# Altium project DARKYDEN.PrjPcb (part 11 of 14)

## Sheet P3V3_PP5V_GESTION.SchDoc: DARKYDEN_P3V3_PP5V_GESTION
size Letter; ApprovedBy: APPROUVÉ PAR; Author: Harold Malbrouck; Organization: Cegep Limoilou; Address1: 1300, 8e Avenue; Address2: Québec, QC; Address3: Canada; Address4: G1J 5L5; Revision: Rev.A; SheetNumber: 20; SheetTotal: 22
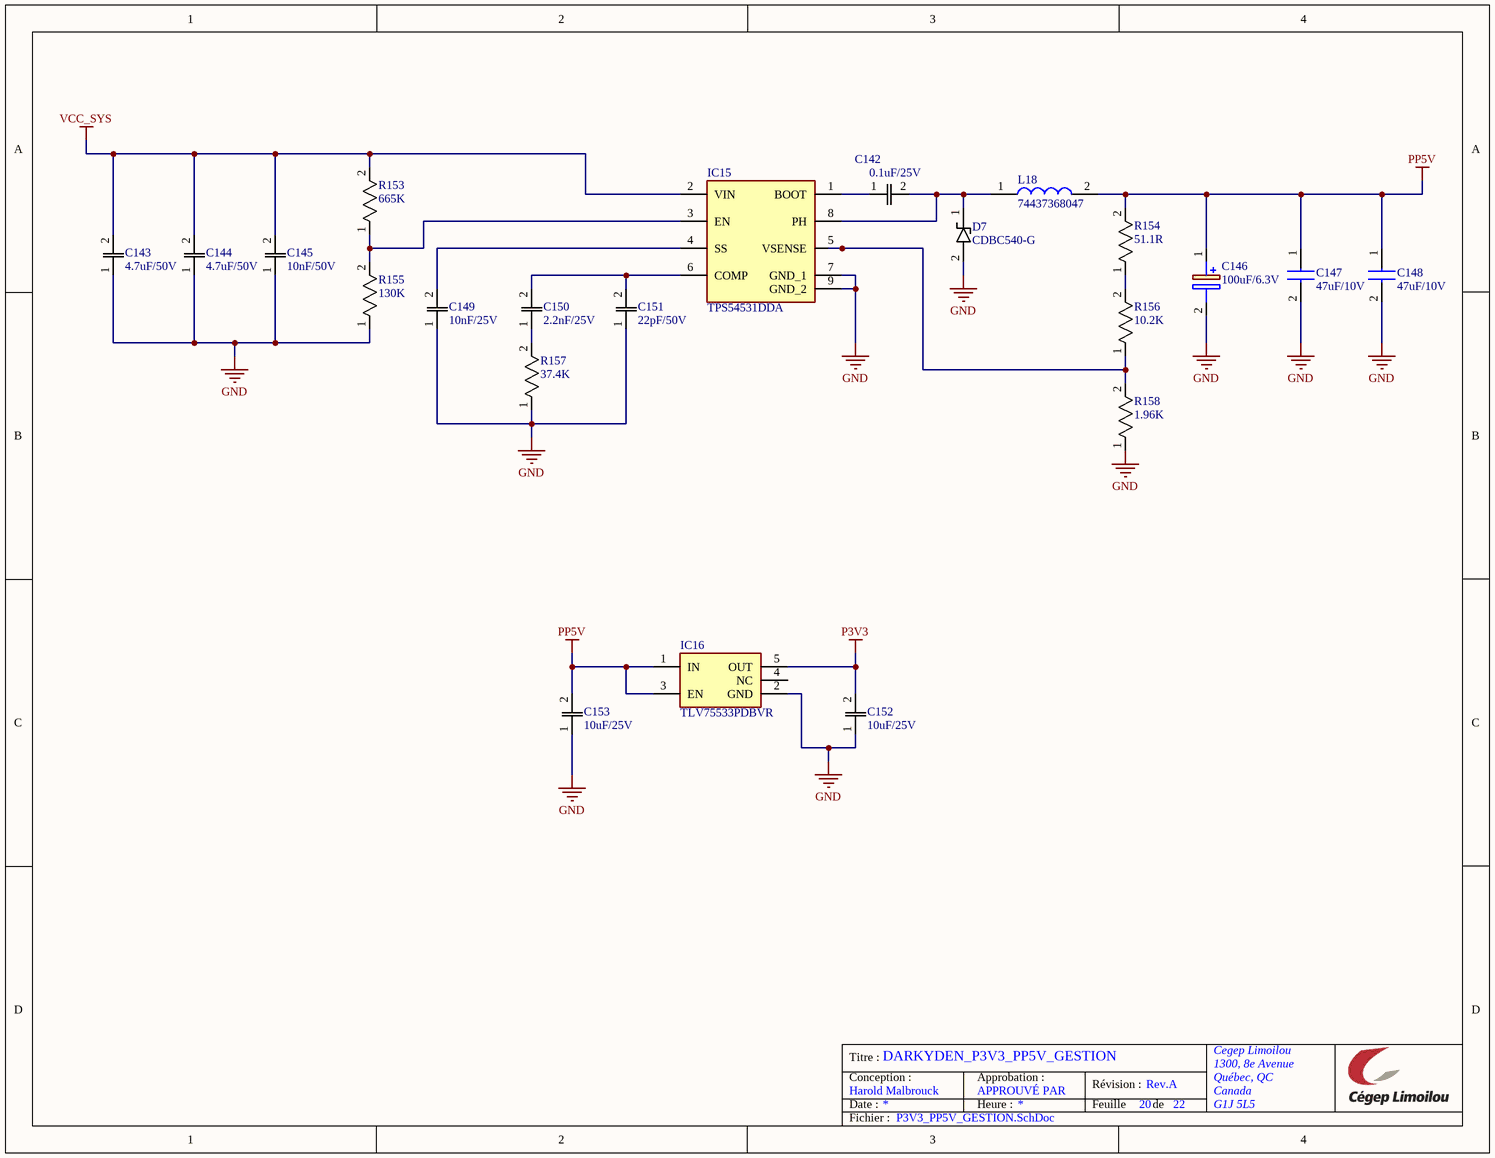
[diagram p12: P3V3_PP5V_GESTION.SchDoc]

### Parts
C142  0.1uF/25V  [CAPC220145_88N_KEM]
C143  4.7uF/50V  [CAP_2012_TDK]
C144  4.7uF/50V  [CAP_2012_TDK]
C145  10nF/50V  [CAPC220145_88N_KEM]
C146  100uF/6.3V  [T520B]
C147  47uF/10V  [CAPC3225X270N]
C148  47uF/10V  [CAPC3225X270N]
C149  10nF/25V  [C0805]
C150  2.2nF/25V  [CAPC480350_110N_KEM]
C151  22pF/50V  [CAPC220145_145N_KEM]
C152  10uF/25V  [CAPC220145_88N_KEM]
C153  10uF/25V  [CAPC220145_88N_KEM]
D7  CDBC540-G  [DIOM8059X290N]
IC15  TPS54531DDA  [SOIC127P600X170-9N]
IC16  TLV75533PDBVR  [SOT95P280X145-5N]
L18  74437368047  [WE-LHMI_104048]
R153  665K  [RC0603N_PAN]
R154  51.1R  [RESC1608X55N]
R155  130K  [RC0603N_PAN]
R156  10.2K  [RESC1608X55N]
R157  37.4K  [RC0603N_PAN]
R158  1.96K  [RC0603N_PAN]

### Nets
GND: C143.1 C144.1 C145.1 C146.2(-) C147.2 C148.2 C149.1 C151.1 C152.1 C153.1 D7.2(A) IC15.7(GND_1) IC15.9(GND_2) IC16.2(GND) R155.1 R157.1 R158.1  [project net PACK-]
P3V3: C152.2 IC16.5(OUT)
PP5V: C146.1(+) C147.1 C148.1 C153.2 IC16.1(IN) IC16.3(EN) L18.2 R154.2
VCC_SYS: C143.2 C144.2 C145.2 IC15.2(VIN) R153.2
NetC142_1: C142.1 IC15.1(BOOT)
NetC142_2: C142.2 D7.1(K) IC15.8(PH) L18.1
NetC149_2: C149.2 IC15.4(SS)
NetC150_1: C150.1 R157.2
NetC150_2: C150.2 C151.2 IC15.6(COMP)
NetIC15_3: IC15.3(EN) R153.1 R155.2
NetIC15_5: IC15.5(VSENSE) R156.1 R158.2
NetR154_1: R154.1 R156.2

Not connected (* = marked no-connect by the designer): IC16 4(NC)

### Notes on the sheet
- Titre :
- Conception :
- Date :
- Approbation :
- Heure :
- Révision :
- Feuille
- de
- Fichier :

### Library data of the parts
C142 = C0805C104K3RACTU: as C94 on sheet POWERSYSTEM; Supplier: Digikey; Supplier Part Number: 399-C0805C104K3RACTUCT-ND; Manufacturer: KEMET; Manufacturer Part Number: C0805C104K3RACTU; RoHS: Yes; Category: Ceramic Capacitors; Mounting Technology: Surface Mount,PCB; Case/Package: 0805; Pins: 2NUMBER; Case Code (Imperial): 0805; Case Code (Metric): 2012; Min Operating Temperature: -55°C; Max Operating Temperature: 125°C; Packaging: Tape and Reel; Tolerance: 10%; Dielectric: X7R; Termination: SMD/SMT; Package Quantity: 4000; Voltage Rating: 25V; Series: SMD Comm X7R; Voltage Rating (DC): 25V; Construction: Flat; Length: 2mm; Width: 1.2mm; Height: 0.9mm; Depth: 1.25mm; Lead Pitch: 0.75mm; Thickness: 889um; Radiation Hardening: No; RoHS Compliant: Yes; Lead Free: 5697LeadFree; Reach SVHC Compliant: 4186SVHC; ComponentLink1URL: https://datasheet.ciiva.com/7842/kem-c1002-x7r-smd-7842536.pdf?src-supplier=Element14; ComponentLink1Description: https://datasheet.ciiva.com/7842/kem-c1002-x7r-smd-7842536.pdf?src-supplier=Element14; ComponentLink2URL: https://datasheet.ciiva.com/7842/kem-c1002-x7r-smd-7842538.pdf?src-supplier=Element14; ComponentLink2Description: https://datasheet.ciiva.com/7842/kem-c1002-x7r-smd-7842538.pdf?src-supplier=Element14
C143 C144 = CGA4J3X5R1H475K125AB: 4.7uF/50V X5R 卤10% 0805 Multilayer Ceramic Capacitors MLCC - SMD/SMT ROHS; Mfr_Name: TDK; Material: 4241ConductorMaterial; Tolerance: 10%; Value: 4.7uF; Voltage Rating: 50V; Supplier: Digikey; Supplier Part Number: 445-7882-1-ND; Manufacturer: TDK; Manufacturer Part Number: CGA4J3X5R1H475K125AB; RoHS: Yes; Category: Ceramic Capacitors; Stock: 1114173; Pricing: 1=0.42, 10=0.252, 100=0.1666, 1000=0.1226 (USD); Mounting Technology: Surface Mount; Case/Package: 0805; Case Code (Metric): 2012; Case Code (Imperial): 0805; Weight: 0.000194oz; Min Operating Temperature: -55°C; Max Operating Temperature: 85°C; Packaging: Tape and Reel; Package Quantity: 2000; Voltage Rating (DC): 50V; Dielectric: X5R; Termination: SMD/SMT; Voltage: 50V; Series: CGA; Length: 2mm; Width: 1.25mm; Height: 1.25mm; Depth: 1.25mm; Ratings: AEC-Q200; Reach SVHC Compliant: No; RoHS Compliant: Yes; Lead Free: 5697LeadFree; ComponentLink1URL: https://datasheet.ciiva.com/24216/cga4j3x5r1h475k125ab-266053-24216004.pdf?src-supplier=Mouser; ComponentLink1Description: https://datasheet.ciiva.com/24216/cga4j3x5r1h475k125ab-266053-24216004.pdf?src-supplier=Mouser; ComponentLink2URL: https://datasheet.ciiva.com/7975/1807242-7975439.pdf?src-supplier=Element14; ComponentLink2Description: https://datasheet.ciiva.com/7975/1807242-7975439.pdf?src-supplier=Element14; ComponentLink3URL: https://datasheet.ciiva.com/22703/1807242-22703720.pdf?src-supplier=Element14; ComponentLink3Description: https://datasheet.ciiva.com/22703/1807242-22703720.pdf?src-supplier=Element14
C145 = C0805C103K5RACTU: 10nF/50V X7R 0805 10%; Mfr_Name: Kemet; Dielectric Material: Ceramic; Value: 10nF; Voltage Rating: 50V; Temperature Coefficient: 30ppm/°C; Supplier: Digikey; Supplier Part Number: 399-C0805C103K5RACTUCT-ND; Manufacturer: KEMET; Manufacturer Part Number: C0805C103K5RACTU; RoHS: Yes; Category: Ceramic Capacitors; Stock: 1014415; Pricing: 1=0.17, 10=0.11, 100=0.0576, 1000=0.0384, 4000=0.0104, 8000=0.01 (USD); Mounting Technology: Surface Mount; Case/Package: 0805; Pins: 2NUMBER; Case Code (Imperial): 0805; Case Code (Metric): 2012; Material: Ceramic; Min Operating Temperature: -55°C; Max Operating Temperature: 125°C; Tolerance: 10%; Packaging: Tape and Reel; Dielectric: X7R; Voltage: 50V; Construction: Flat; Series: SMD Comm X7R; Voltage Rating (AC): 50V; Length: 2mm; Height: 0.78mm; Depth: 1.25mm; Thickness: 889um; Radiation Hardening: No; Reach SVHC Compliant: 4186SVHC; Lead Free: 5697LeadFree
C146 = T520B107M006ATE015: 100uF / 6.3VDC B CASE 20%  Cap Tant Polymer SMD 3528-21 0.015 Ohm 105C T/R; Manufacturer_Name: KEMET; Dielectric Material: Tantalum; ESR (Equivalent Series Resistance): 15mR; Voltage Rating: 6.3V; Polarity: Polar; Dissipation Factor: 8%; Leakage Current: 63uA; Ripple Current: 2.9A; Datasheet Link: https://content.kemet.com/datasheets/KEM_T2076_T52X-530.pdf; Height: 2mm; Manufacturer_Part_Number: T520B107M006ATE015; Mouser Part Number: 80-T520B107M6ATE15; Mouser Price/Stock: https://www.mouser.co.uk/ProductDetail/KEMET/T520B107M006ATE015?qs=OJGUyRWaYtOytoGOf%2F5t0w%3D%3D; Arrow Part Number: T520B107M006ATE015; Arrow Price/Stock: https://www.arrow.com/en/products/t520b107m006ate015/kemet-corporation?region=nac; Supplier: Digikey; Supplier Part Number: 399-5306-1-ND; Manufacturer: KEMET; Manufacturer Part Number: T520B107M006ATE015; RoHS: Yes; Category: Polymer Capacitors; Stock: 29629; Pricing: 1=1.5, 10=0.989, 50=0.7882, 100=0.726, 500=0.621, 1000=0.58851 (USD); Mounting Technology: Surface Mount; Case/Package: 1411; Pins: 2; Case Code (Metric): 3528; Case Code (Imperial): 1411; Material: Polymer; Min Operating Temperature: -55°C; Max Operating Temperature: 105°C; Packaging: Tape and Reel; Package Quantity: 2000; Series: KO-CAP® T520; Value: 100uF; Tolerance: 20%; Voltage Rating (DC): 6.3V; Termination: SMD/SMT; Voltage: 6.3V; Features: General Purpose; Construction: Flat; Length: 3.5mm; Width: 2.8mm; Depth: 2.8mm; Radiation Hardening: No; RoHS Compliant: Yes; Reach SVHC Compliant: No; ComponentLink1URL: https://datasheet.ciiva.com/22691/1759391-22691465.pdf?src-supplier=Element14; ComponentLink1Description: https://datasheet.ciiva.com/22691/1759391-22691465.pdf?src-supplier=Element14; ComponentLink2URL: https://datasheet.ciiva.com/11793/0900766b80df3fa9-11793075.pdf?src-supplier=Rs; ComponentLink2Description: https://datasheet.ciiva.com/11793/0900766b80df3fa9-11793075.pdf?src-supplier=Rs; ComponentLink3URL: https://datasheet.ciiva.com/260/kem-t2015-t520-260611.pdf?src-supplier=Digikey; ComponentLink3Description: https://datasheet.ciiva.com/260/kem-t2015-t520-260611.pdf?src-supplier=Digikey; ComponentLink4URL: https://datasheet.ciiva.com/260/kem-t2015-t520-260612.pdf?src-supplier=Digikey; ComponentLink4Description: https://datasheet.ciiva.com/260/kem-t2015-t520-260612.pdf?src-supplier=Digikey; ComponentLink5URL: https://datasheet.ciiva.com/260/kem-t2015-t520-260613.pdf?src-supplier=Digikey; ComponentLink5Description: https://datasheet.ciiva.com/260/kem-t2015-t520-260613.pdf?src-supplier=Digikey; ComponentLink6URL: https://datasheet.ciiva.com/5459/kem-t2015-t520-368569-5459447.pdf?src-supplier=Mouser; ComponentLink6Description: https://datasheet.ciiva.com/5459/kem-t2015-t520-368569-5459447.pdf?src-supplier=Mouser
C147 C148 = GRM32ER61A476KE20L: Multilayer Ceramic Capacitor, 47 uF, 10 V, ï¿½ 10%, X5R, 1210 [3225 Metric]; Manufacturer_Name: Murata Electronics; Manufacturer: Murata; Voltage Rating: 10V; Value: 47uF; Tolerance: 20%; Datasheet Link: https://search.murata.co.jp/Ceramy/image/img/A01X/G101/ENG/GRM32ER61A476KE20-01A.pdf; Height: 2.7mm; Manufacturer_Part_Number: GRM32ER61A476KE20L; Mouser Part Number: 81-GRM32ER61A476KE20; Mouser Price/Stock: https://www.mouser.co.uk/ProductDetail/Murata-Electronics/GRM32ER61A476KE20L?qs=CHiu0TXTCq9PIq9fz1sbVg%3D%3D; Arrow Part Number: GRM32ER61A476KE20L; Arrow Price/Stock: https://www.arrow.com/en/products/grm32er61a476ke20l/murata-manufacturing?region=nac; Supplier: Digikey; Supplier Part Number: 490-3887-1-ND; Manufacturer Part Number: GRM32ER61A476KE20L; RoHS: Yes; Category: Ceramic Capacitors; Stock: 48000; Pricing: 1=1.59, 10=1.058, 100=0.7798 (USD); Mounting Technology: Surface Mount; Case/Package: 1210; Case Code (Imperial): 1210; Case Code (Metric): 3225; Material: Ceramic; Min Operating Temperature: -55°C; Max Operating Temperature: 85°C; Packaging: Tape and Reel; Package Quantity: 1; Termination: SMD/SMT; Series: GRM; Voltage Rating (DC): 10V; Dielectric: X5R; Voltage: 10V; Construction: Flat; Length: 3.2mm; Width: 0.098inch; Thickness: 0.106inch; Depth: 2.5mm; Radiation Hardening: No; Reach SVHC Compliant: No; RoHS Compliant: Yes; Lead Free: Lead Free; ComponentLink1URL: https://datasheet.ciiva.com/143/grm32er61a476ke20-01-143003.pdf?src-supplier=Digikey; ComponentLink1Description: https://datasheet.ciiva.com/143/grm32er61a476ke20-01-143003.pdf?src-supplier=Digikey; ComponentLink2URL: https://datasheet.ciiva.com/143/grm32er61a476ke20-01-143004.pdf?src-supplier=Digikey; ComponentLink2Description: https://datasheet.ciiva.com/143/grm32er61a476ke20-01-143004.pdf?src-supplier=Digikey; ComponentLink3URL: https://datasheet.ciiva.com/3778/1774grm32er61a476ke2023-3778403.pdf?src-supplier=Arrow+Electronics; ComponentLink3Description: https://datasheet.ciiva.com/3778/1774grm32er61a476ke2023-3778403.pdf?src-supplier=Arrow+Electronics; ComponentLink4URL: https://datasheet.ciiva.com/143/grm32er61a476ke20-01-143002.pdf?src-supplier=Digikey; ComponentLink4Description: https://datasheet.ciiva.com/143/grm32er61a476ke20-01-143002.pdf?src-supplier=Digikey; ComponentLink5URL: https://datasheet.ciiva.com/2989/product-2989812.pdf?src-supplier=Avnet; ComponentLink5Description: https://datasheet.ciiva.com/2989/product-2989812.pdf?src-supplier=Avnet; ComponentLink6URL: https://datasheet.ciiva.com/11606/product-11606490.pdf?src-supplier=Avnet; ComponentLink6Description: https://datasheet.ciiva.com/11606/product-11606490.pdf?src-supplier=Avnet
C149 = C0805C103K3RACTU: 0.01uF 25V X7R 10% SMD 0805 125C Paper T/R; Manufacturer_Name: KEMET; Dielectric Material: Ceramic; Material: 4241ConductorMaterial; Value: 10nF; Dissipation Factor: 3.5%; Temperature Coefficient: 30ppm/°C; Datasheet Link: https://content.kemet.com/datasheets/KEM_C1002_X7R_SMD.pdf; Height: 1.1mm; Manufacturer_Part_Number: C0805C103K3RACTU; Mouser Part Number: 80-C0805C103K3R; Mouser Price/Stock: https://www.mouser.co.uk/ProductDetail/KEMET/C0805C103K3RACTU?qs=5x48ZXzl2vJVSrNkrDG8kg%3D%3D; Arrow Part Number: C0805C103K3RACTU; Arrow Price/Stock: https://www.arrow.com/en/products/c0805c103k3ractu/kemet-corporation; Supplier: Digikey; Supplier Part Number: 399-C0805C103K3RACTUCT-ND; Manufacturer: KEMET; Manufacturer Part Number: C0805C103K3RACTU; RoHS: Yes; Category: Ceramic Capacitors; Stock: 5327; Pricing: 1=0.12, 10=0.066, 100=0.0398, 1000=0.03092 (USD); Mounting Technology: Surface Mount; Case/Package: 0805; Case Code (Metric): 2012; Case Code (Imperial): 0805; Min Operating Temperature: -55°C; Max Operating Temperature: 125°C; Package Quantity: 4000; Voltage Rating: 25V; Tolerance: 10%; Packaging: Tape and Reel; Voltage Rating (DC): 25V; Dielectric: X7R; Termination: SMD/SMT; Series: SMD Comm X7R; Construction: Flat; Length: 2mm; Width: 1.2mm; Thickness: 0.035inch; Lead Pitch: 0.75mm; Depth: 1.25mm; Radiation Hardening: No; Reach SVHC Compliant: No; RoHS Compliant: Yes; ComponentLink1URL: http://www.farnell.com/datasheets/2746089.pdf?src-supplier=Farnell; ComponentLink1Description: http://www.farnell.com/datasheets/2746089.pdf?src-supplier=Farnell; ComponentLink2URL: http://www.farnell.com/datasheets/2315422.pdf?src-supplier=Farnell; ComponentLink2Description: http://www.farnell.com/datasheets/2315422.pdf?src-supplier=Farnell; ComponentLink3URL: http://components.arrow.com/part/dataview/2091057S98063N7429?src-supplier=Arrow+Electronics; ComponentLink3Description: http://components.arrow.com/part/dataview/2091057S98063N7429?src-supplier=Arrow+Electronics; ComponentLink4URL: http://www.mouser.com/ds/2/212/KEM_C1002_X7R_SMD-1102033.pdf?src-supplier=Mouser; ComponentLink4Description: http://www.mouser.com/ds/2/212/KEM_C1002_X7R_SMD-1102033.pdf?src-supplier=Mouser; ComponentLink5URL: https://www.verical.com/server-webapp/html/getDatasheet?partID=697850&src-supplier=Verical; ComponentLink5Description: https://www.verical.com/server-webapp/html/getDatasheet?partID=697850&src-supplier=Verical; ComponentLink6URL: http://www.jameco.com/Jameco/Products/ProdDS/1637716.pdf?src-supplier=Jameco; ComponentLink6Description: http://www.jameco.com/Jameco/Products/ProdDS/1637716.pdf?src-supplier=Jameco; ComponentLink7URL: https://api.kemet.com/component-edge/download/datasheet/C0805C103K3RACTU.pdf?src-supplier=Digikey; ComponentLink7Description: https://api.kemet.com/component-edge/download/datasheet/C0805C103K3RACTU.pdf?src-supplier=Digikey; ComponentLink8URL: http://capacitoredge.kemet.com/capedge2/DataSheet?pn=C0805C103K3RACTU&src-supplier=Avnet; ComponentLink8Description: http://capacitoredge.kemet.com/capedge2/DataSheet?pn=C0805C103K3RACTU&src-supplier=Avnet; ComponentLink9URL: http://www.farnell.com/datasheets/2746089.pdf?src-supplier=Newark; ComponentLink9Description: http://www.farnell.com/datasheets/2746089.pdf?src-supplier=Newark; ComponentLink10URL: https://datasheet.octopart.com/C0805C103K3RACTU-KEMET-datasheet-37550250.pdf?src-supplier=Electro+Sonic; ComponentLink10Description: https://datasheet.octopart.com/C0805C103K3RACTU-KEMET-datasheet-37550250.pdf?src-supplier=Electro+Sonic; ComponentLink11URL: https://datasheet.octopart.com/C0805C103K3RACTU-KEMET-datasheet-130259678.pdf?src-supplier=TME; ComponentLink11Description: https://datasheet.octopart.com/C0805C103K3RACTU-KEMET-datasheet-130259678.pdf?src-supplier=TME
C150 = C0805C222K3GECTU: 2.2nF ±10% 25V Ceramic Capacitor C0G, NP0 0805 (2012 Metric); Mfr_Name: Kemet; Supplier: Digikey; Supplier Part Number: 399-C0805C222K3GECTUCT-ND; Manufacturer: KEMET; Manufacturer Part Number: C0805C222K3GECTU; RoHS: Yes; Stock: 4796; Pricing: 1=0.2, 10=0.117, 100=0.0734, 1000=0.05087 (USD); RoHS Compliant: Yes
C151 = C0805C220J5RACTU: Cap Ceramic 22pF 50V X7R 5% Pad SMD 0805 125°C T/R; Mfr_Name: Kemet; Temperature Coefficient: 30ppm/°C; Supplier: Digikey; Supplier Part Number: 399-17625-1-ND; Manufacturer: KEMET; Manufacturer Part Number: C0805C220J5RACTU; RoHS: Yes; Category: Ceramic Capacitors; Stock: 8069; Pricing: 1=0.13, 10=0.072, 100=0.0434, 1000=0.02906 (USD); Case/Package: 0805; Material: Ceramic; Dielectric Material: Ceramic; Min Operating Temperature: -55°C; Max Operating Temperature: 125°C; Value: 22pF; Dielectric: X7R; Voltage Rating: 50V; Voltage Rating (DC): 50V; Height: 880um; RoHS Compliant: Yes; ComponentLink1URL: https://datasheet.octopart.com/C0805C220J5RACTU-KEMET-datasheet-130256537.pdf?src-supplier=Farnell; ComponentLink1Description: https://datasheet.octopart.com/C0805C220J5RACTU-KEMET-datasheet-130256537.pdf?src-supplier=Farnell; ComponentLink2URL: https://datasheet.octopart.com/C0805C220J5RACTU-KEMET-datasheet-170333836.pdf?src-supplier=Newark; ComponentLink2Description: https://datasheet.octopart.com/C0805C220J5RACTU-KEMET-datasheet-170333836.pdf?src-supplier=Newark
C152 C153 = C0805C106K3PACTU: as C87-C89 on sheet POWERSYSTEM; Mfr_Name: Kemet; Supplier: Digikey; Supplier Part Number: 399-11939-1-ND; Manufacturer: KEMET; Manufacturer Part Number: C0805C106K3PACTU; RoHS: Yes; Category: Ceramic Capacitors; Case/Package: 0805; Case Code (Metric): 2012; Case Code (Imperial): 0805; Min Operating Temperature: -55°C; Max Operating Temperature: 85°C; Dielectric: X5R; Packaging: Cut Tape; Voltage: 25V; Termination: Solder; Tolerance: 10%; Value: 10uF; Series: SMD Comm X5R; Voltage Rating (DC): 25V; Length: 2mm; Height: 1.25mm; Depth: 1.25mm; Reach SVHC Compliant: No; RoHS Compliant: Yes; Lead Free: 5697LeadFree; ComponentLink1URL: http://www.farnell.com/datasheets/2741185.pdf?src-supplier=Farnell; ComponentLink1Description: http://www.farnell.com/datasheets/2741185.pdf?src-supplier=Farnell; ComponentLink2URL: http://www.alliedelec.com/m/d/f3c02ddb98afa3dd1adcb801109671e9.pdf?src-supplier=Allied+Electronics; ComponentLink2Description: http://www.alliedelec.com/m/d/f3c02ddb98afa3dd1adcb801109671e9.pdf?src-supplier=Allied+Electronics; ComponentLink3URL: https://api.kemet.com/component-edge/download/datasheet/C0805C106K3PAC7800.pdf?src-supplier=Digikey; ComponentLink3Description: https://api.kemet.com/component-edge/download/datasheet/C0805C106K3PAC7800.pdf?src-supplier=Digikey; ComponentLink4URL: http://www.kemet.com/Lists/ProductCatalog/Attachments/19/KEM_C1006_X5R_SMD.pdf?src-supplier=Avnet; ComponentLink4Description: http://www.kemet.com/Lists/ProductCatalog/Attachments/19/KEM_C1006_X5R_SMD.pdf?src-supplier=Avnet; ComponentLink5URL: http://www.farnell.com/datasheets/2741185.pdf?src-supplier=Element14; ComponentLink5Description: http://www.farnell.com/datasheets/2741185.pdf?src-supplier=Element14; ComponentLink6URL: http://www.farnell.com/datasheets/2741185.pdf?src-supplier=Newark; ComponentLink6Description: http://www.farnell.com/datasheets/2741185.pdf?src-supplier=Newark; ComponentLink7URL: https://datasheet.octopart.com/C0805C106K3PACTU-Kemet-datasheet-46909776.pdf?src-supplier=Element14; ComponentLink7Description: https://datasheet.octopart.com/C0805C106K3PACTU-Kemet-datasheet-46909776.pdf?src-supplier=Element14
D7 = CDBC540-G: Schottky Diode 40V 5A 2-Pin DO-214AB (SMC) CDBC540-G SMT; Manufacturer_Name: Comchip Technology; Manufacturer: Comchip; Max Surge Current: 100A; Max Reverse Leakage Current: 500uA; Datasheet Link: https://eu.mouser.com/datasheet/2/80/CDBC520-HF_Thru195340._CDBC5100-HF_RevB-1480991.pdf; Height: 2.9mm; Manufacturer_Part_Number: CDBC540-G; Mouser Part Number: 750-CDBC540-G; Mouser Price/Stock: https://www.mouser.co.uk/ProductDetail/Comchip-Technology/CDBC540-G?qs=tw%252BuQ%2FB6PO2ExpPYY64Vzw%3D%3D; Arrow Part Number: CDBC540-G; Arrow Price/Stock: https://www.arrow.com/en/products/cdbc540-g/comchip-technology?utm_currency=USD&region=nac; Supplier: Digikey; Supplier Part Number: 641-1126-1-ND; Manufacturer Part Number: CDBC540-G; RoHS: Yes; Category: Rectifier Diodes; Stock: 176247; Pricing: 1=0.67, 10=0.526, 100=0.4172, 500=0.32184, 1000=0.2911 (USD); Mounting Technology: Surface Mount; Case/Package: DO-214AB; Pins: 2; Package Quantity: 3000; Packaging: Tape and Reel; Average Rectified Current: 5A; Max Reverse Voltage (DC): 40V; Series: -; RoHS Compliant: Yes; ComponentLink1URL: https://datasheet.ciiva.com/914/cdbc520-gthru936981-cdbc5100-grevc-914747.pdf?src-supplier=Digikey; ComponentLink1Description: https://datasheet.ciiva.com/914/cdbc520-gthru936981-cdbc5100-grevc-914747.pdf?src-supplier=Digikey; ComponentLink2URL: https://datasheet.ciiva.com/914/cdbc520-gthru936981-cdbc5100-grevc-914748.pdf?src-supplier=Digikey; ComponentLink2Description: https://datasheet.ciiva.com/914/cdbc520-gthru936981-cdbc5100-grevc-914748.pdf?src-supplier=Digikey; ComponentLink3URL: https://datasheet.ciiva.com/914/cdbc520-gthru936981-cdbc5100-grevc-914749.pdf?src-supplier=Digikey; ComponentLink3Description: https://datasheet.ciiva.com/914/cdbc520-gthru936981-cdbc5100-grevc-914749.pdf?src-supplier=Digikey
IC15 = TPS54531DDA: Buck Switching Regulator IC Positive Adjustable 0.8V 1 Output 5A 8-PowerSOIC (0.154", 3.90mm Width); Manufacturer_Name: Texas Instruments; Datasheet Link: http://www.ti.com/lit/gpn/tps54531; Height: 1.7mm; Manufacturer_Part_Number: TPS54531DDA; Mouser Part Number: 595-TPS54531DDA; Mouser Price/Stock: https://www.mouser.co.uk/ProductDetail/Texas-Instruments/TPS54531DDA?qs=jA5Ki6243omoJVKISZs%2FBg%3D%3D; Arrow Part Number: TPS54531DDA; Arrow Price/Stock: https://www.arrow.com/en/products/tps54531dda/texas-instruments?utm_currency=USD&region=nac
IC16 = TLV75533PDBVR: 500mA high-PSRR low-IQ low-dropout voltage regulator with enable 5-SOT-23 -40 to 125; Manufacturer_Name: Texas Instruments; Output Type: Fixed; Output Configuration: Positive; Number of Regulators: 1; Max Supply Voltage: 5.5V; Min Output Voltage: 3.3V; Quiescent Current: 31uA; Power Supply Rejection Ratio (PSRR): 52dB; Accuracy: 1%; Min Supply Voltage: 1.45V; Number of Channels: 1NUMBER; Datasheet Link: http://www.ti.com/lit/gpn/tlv755p; Height: 1.45mm; Manufacturer_Part_Number: TLV75533PDBVR; Mouser Part Number: 595-TLV75533PDBVR; Mouser Price/Stock: https://www.mouser.co.uk/ProductDetail/Texas-Instruments/TLV75533PDBVR?qs=55YtniHzbhAKEwqeO2xJXQ%3D%3D; Arrow Part Number: TLV75533PDBVR; Arrow Price/Stock: https://www.arrow.com/en/products/tlv75533pdbvr/texas-instruments?utm_currency=USD&region=europe; Supplier: Digikey; Supplier Part Number: 296-50411-1-ND; Manufacturer: Texas Instruments; Manufacturer Part Number: TLV75533PDBVR; RoHS: Yes; Category: Voltage Regulators - Linear; Stock: 14166; Pricing: 1=0.32, 10=0.218, 25=0.1936, 100=0.1665, 250=0.15364, 500=0.1459, 1000=0.13951 (USD); Mounting Technology: Surface Mount; Case/Package: SOT-23-5; Pins: 5NUMBER; Min Operating Temperature: -40°C; Max Operating Temperature: 125°C; Packaging: Cut Tape; Output Current: 500mA; Series: -; Number of Outputs: 1NUMBER; Output Voltage: 3.3V; Length: 2.9mm; Width: 1.6mm; Thickness: 1.2mm; RoHS Compliant: Yes; ComponentLink1URL: http://www.ti.com/lit/ds/symlink/tlv755p.pdf?src-supplier=Digikey; ComponentLink1Description: http://www.ti.com/lit/ds/symlink/tlv755p.pdf?src-supplier=Digikey; ComponentLink2URL: http://www.ti.com/general/docs/suppproductinfo.tsp?distId=10&amp;gotoUrl=http%3A%2F%2Fwww.ti.com%2Flit%2Fgpn%2Ftlv755p&src-supplier=Digikey; ComponentLink2Description: http://www.ti.com/general/docs/suppproductinfo.tsp?distId=10&amp;gotoUrl=http%3A%2F%2Fwww.ti.com%2Flit%2Fgpn%2Ftlv755p&src-supplier=Digikey
L18 = 74437368047: WE-LHMI SMT POWER INDUCTOR General Purpose Inductor, 4.7uH, 20%, 1 Element, Powdered Iron-Core, SMD, 4339; Manufacturer_Name: Wurth Elektronik; Manufacturer: Wurth Electronics; Core Material: Ferrite,Composite; Saturation Current: 19A; Shielding: Shielded; Self Resonant Frequency: 16MHz; DC Resistance (DCR): 15.5mR; Test Frequency: 100kHz; Max DC Current: 7A; Manufacturer_Part_Number: 74437368047; Mouser Part Number: 710-74437368047; Mouser Price/Stock: https://www.mouser.co.uk/ProductDetail/Wurth-Elektronik/74437368047?qs=cFlH0mFHHFp7ho41z0ed1Q%3D%3D; Supplier: Digikey; Supplier Part Number: 732-3389-1-ND; Manufacturer Part Number: 74437368047; RoHS: Yes; Category: Fixed Inductors; Stock: 3359; Pricing: 1=2.31, 10=2.264, 50=2.089, 100=1.9152, 250=1.82792 (USD); Mounting Technology: Surface Mount; Case/Package: Nonstandard; Min Operating Temperature: -40°C; Max Operating Temperature: 125°C; Tolerance: 20%; Packaging: Tape and Reel; Value: 4.7uH; Termination: SMD/SMT; Series: WE-LHMI; Package Quantity: 1; Current Rating: 7A; Inductance Tolerance: 20%; Frequency: 16MHz; RMS Current (Irms): 7A; ESR: 15.5mR; Length: 11mm; Width: 10mm; Height: 3.8mm; Height - Seated (Max): 0.157inch; Depth: 10mm; RoHS Compliant: Yes; Reach SVHC Compliant: Unknown; ComponentLink1URL: https://datasheet.ciiva.com/1060/74437368047-1060832.pdf?src-supplier=Digikey; ComponentLink1Description: https://datasheet.ciiva.com/1060/74437368047-1060832.pdf?src-supplier=Digikey; ComponentLink2URL: https://datasheet.ciiva.com/7691/1735873-7691597.pdf?src-supplier=Element14; ComponentLink2Description: https://datasheet.ciiva.com/7691/1735873-7691597.pdf?src-supplier=Element14; ComponentLink3URL: https://datasheet.ciiva.com/4961/74437368047-68825-4961315.pdf?src-supplier=Mouser; ComponentLink3Description: https://datasheet.ciiva.com/4961/74437368047-68825-4961315.pdf?src-supplier=Mouser
R153 = ERJ-3EKF6653V: 665 kOhm, ± 1%, 100 mW, 0603 [1608 Metric], Thick Film, Precision; Mfr_Name: Panasonic; Value: 665kR; Power Rating: 100mW; Voltage Rating: 75V; Temperature Coefficient: 100ppm/°C; Voltage Rating (DC): 50V; Supplier: Digikey; Supplier Part Number: P665KHCT-ND; Manufacturer: Panasonic; Manufacturer Part Number: ERJ-3EKF6653V; RoHS: Yes; Category: Chip SMD Resistors; Stock: 26342; Pricing: 1=0.1, 10=0.035, 100=0.0177, 1000=0.01014, 2500=0.00847 (USD); Mounting Technology: Surface Mount; Case/Package: 0603; Case Code (Metric): 1608; Case Code (Imperial): 0603; Contact Plating: Tin; Min Operating Temperature: -55°C; Max Operating Temperature: 155°C; Tolerance: 1%; Packaging: Tape and Reel; Package Quantity: 5000; Resistor Type: Thick Film; Number of Terminations: 2; Termination: SMD/SMT; Max Power Dissipation: 100mW; Features: Automotive AEC-Q200; Series: ERJ; Construction: Rectangular; Resistance Tolerance: 1%; Length: 1.6mm; Width: 0.8mm; Height: 0.022inch; Depth: 0.8mm; Reach SVHC Compliant: Yes; Military Standard: Not; RoHS Compliant: Yes; ComponentLink1URL: https://datasheet.ciiva.com/9180/aoa0000ce2-9180543.pdf?src-supplier=Avnet; ComponentLink1Description: https://datasheet.ciiva.com/9180/aoa0000ce2-9180543.pdf?src-supplier=Avnet; ComponentLink2URL: https://datasheet.ciiva.com/7754/1678782-7754015.pdf?src-supplier=Element14; ComponentLink2Description: https://datasheet.ciiva.com/7754/1678782-7754015.pdf?src-supplier=Element14; ComponentLink3URL: https://datasheet.ciiva.com/22668/1678782-22668429.pdf?src-supplier=Element14; ComponentLink3Description: https://datasheet.ciiva.com/22668/1678782-22668429.pdf?src-supplier=Element14; ComponentLink4URL: https://datasheet.ciiva.com/46420/1678782-46420005.pdf?src-supplier=Element14; ComponentLink4Description: https://datasheet.ciiva.com/46420/1678782-46420005.pdf?src-supplier=Element14
R154 = ERJ-3EKF51R1V: 51.1 Ohm 1% 0.1W(1/10W) ±100ppm/C Pad SMD T/R Automotive AEC-Q200; Manufacturer_Name: Panasonic; Power Rating: 100mW; Voltage Rating: 75V; Temperature Coefficient: 100ppm/°C; Datasheet Link: http://industrial.panasonic.com/cdbs/www-data/pdf/RDA0000/AOA0000C86.pdf; Height: 0.55mm; Manufacturer_Part_Number: ERJ-3EKF51R1V; Mouser Part Number: 667-ERJ-3EKF51R1V; Mouser Price/Stock: https://www.mouser.com/Search/Refine.aspx?Keyword=667-ERJ-3EKF51R1V; Arrow Part Number: ERJ-3EKF51R1V; Arrow Price/Stock: https://www.arrow.com/en/products/erj-3ekf51r1v/panasonic?region=europe; Supplier: Digikey; Supplier Part Number: P51.1HCT-ND; Manufacturer: Panasonic; Manufacturer Part Number: ERJ-3EKF51R1V; RoHS: Yes; Category: Chip SMD Resistors; Stock: 86452; Pricing: 1=0.1, 10=0.035, 100=0.0177, 1000=0.01014, 2500=0.00888 (USD); Mounting Technology: Surface Mount; Case/Package: 0603; Case Code (Metric): 1608; Case Code (Imperial): 0603; Contact Plating: Tin; Min Operating Temperature: -55°C; Max Operating Temperature: 155°C; Value: 51.1R; Tolerance: 1%; Packaging: Tape and Reel; Package Quantity: 1; Resistor Type: Thick Film; Number of Terminations: 2; Termination: SMD/SMT; Max Power Dissipation: 100mW; Features: Automotive AEC-Q200; Series: ERJ; Resistance Tolerance: 1%; Construction: Rectangular; Technology: THICK FILM; Length: 1.6mm; Width: 0.8mm; Depth: 0.8mm; Radiation Hardening: No; Reach SVHC Compliant: No; Military Standard: Not; RoHS Compliant: Yes; ComponentLink1URL: https://datasheet.ciiva.com/5870/426256-5870807.pdf?src-supplier=Farnell; ComponentLink1Description: https://datasheet.ciiva.com/5870/426256-5870807.pdf?src-supplier=Farnell; ComponentLink2URL: https://datasheet.ciiva.com/9117/aoa0000ce2-9117163.pdf?src-supplier=Avnet; ComponentLink2Description: https://datasheet.ciiva.com/9117/aoa0000ce2-9117163.pdf?src-supplier=Avnet; ComponentLink3URL: https://datasheet.ciiva.com/9188/aoa0000ce2-9188966.pdf?src-supplier=Avnet; ComponentLink3Description: https://datasheet.ciiva.com/9188/aoa0000ce2-9188966.pdf?src-supplier=Avnet; ComponentLink4URL: https://datasheet.ciiva.com/30066/aoa0000ce2-30066071.pdf?src-supplier=Onlinecomponents.com; ComponentLink4Description: https://datasheet.ciiva.com/30066/aoa0000ce2-30066071.pdf?src-supplier=Onlinecomponents.com; ComponentLink5URL: https://datasheet.ciiva.com/16440/aoa0000ce2-16440167.pdf?src-supplier=Future+Electronics; ComponentLink5Description: https://datasheet.ciiva.com/16440/aoa0000ce2-16440167.pdf?src-supplier=Future+Electronics; ComponentLink6URL: https://datasheet.ciiva.com/16782/70260748-16782813.pdf?src-supplier=Allied+Electronics; ComponentLink6Description: https://datasheet.ciiva.com/16782/70260748-16782813.pdf?src-supplier=Allied+Electronics; ComponentLink7URL: https://datasheet.ciiva.com/46377/426256-46377438.pdf?src-supplier=Element14; ComponentLink7Description: https://datasheet.ciiva.com/46377/426256-46377438.pdf?src-supplier=Element14
R155 = ERJ-3EKF1303V: 130K Ohm 1% 0.1W Res Thick Film 0603 ±100ppm/°C Molded SMD Punched Carrier T/R; Mfr_Name: Panasonic; Value: 130kR; Power Rating: 100mW; Voltage Rating: 75V; Voltage Rating (DC): 50V; Supplier: Digikey; Supplier Part Number: P130KHCT-ND; Manufacturer: Panasonic; Manufacturer Part Number: ERJ-3EKF1303V; RoHS: Yes; Category: Chip SMD Resistors; Stock: 107191; Pricing: 1=0.1, 10=0.035, 100=0.0177, 1000=0.01014, 2500=0.00847 (USD); Mounting Technology: Surface Mount; Case/Package: 0603; Case Code (Metric): 1608; Case Code (Imperial): 0603; Contact Plating: Tin; Min Operating Temperature: -55°C; Max Operating Temperature: 155°C; Tolerance: 1%; Packaging: Tape and Reel; Package Quantity: 1; Resistor Type: Thick Film; Number of Terminations: 2; Termination: SMD/SMT; Temperature Coefficient: 100ppm/°C; Max Power Dissipation: 100mW; Features: Automotive AEC-Q200; Series: ERJ; Construction: Rectangular; Technology: THICK FILM; Resistance Tolerance: 1%; Length: 1.6mm; Width: 0.8mm; Height: 0.45mm; Depth: 0.8mm; Reach SVHC Compliant: No; Military Standard: Not; Lead Free: Lead Free; RoHS Compliant: Yes; ComponentLink1URL: https://datasheet.ciiva.com/5915/426256-5915291.pdf?src-supplier=Farnell; ComponentLink1Description: https://datasheet.ciiva.com/5915/426256-5915291.pdf?src-supplier=Farnell; ComponentLink2URL: https://datasheet.ciiva.com/5915/426256-5915292.pdf?src-supplier=Farnell; ComponentLink2Description: https://datasheet.ciiva.com/5915/426256-5915292.pdf?src-supplier=Farnell; ComponentLink3URL: https://datasheet.ciiva.com/28515/1678782-28515237.pdf?src-supplier=Element14; ComponentLink3Description: https://datasheet.ciiva.com/28515/1678782-28515237.pdf?src-supplier=Element14; ComponentLink4URL: https://datasheet.ciiva.com/28665/1678782-28665400.pdf?src-supplier=Element14; ComponentLink4Description: https://datasheet.ciiva.com/28665/1678782-28665400.pdf?src-supplier=Element14; ComponentLink5URL: https://datasheet.ciiva.com/24070/aoa0000ce2-24070047.pdf?src-supplier=Mouser; ComponentLink5Description: https://datasheet.ciiva.com/24070/aoa0000ce2-24070047.pdf?src-supplier=Mouser; ComponentLink6URL: https://datasheet.ciiva.com/16788/70260748-16788063.pdf?src-supplier=Allied+Electronics; ComponentLink6Description: https://datasheet.ciiva.com/16788/70260748-16788063.pdf?src-supplier=Allied+Electronics; ComponentLink7URL: https://datasheet.ciiva.com/7795/426256-7795210.pdf?src-supplier=Element14; ComponentLink7Description: https://datasheet.ciiva.com/7795/426256-7795210.pdf?src-supplier=Element14
R156 = ERJ-3EKF1022V: 10.2 kOhm, ± 1%, 100 mW, 0603 [1608 Metric], Thick Film, Precision; Manufacturer_Name: Panasonic; Value: 10.2kR; Power Rating: 100mW; Voltage Rating: 75V; Temperature Coefficient: 100ppm/°C; Voltage Rating (DC): 50V; Datasheet Link: http://industrial.panasonic.com/cdbs/www-data/pdf/RDA0000/AOA0000C86.pdf; Height: 0.55mm; Manufacturer_Part_Number: ERJ-3EKF1022V; Mouser Part Number: 667-ERJ-3EKF1022V; Mouser Price/Stock: https://www.mouser.co.uk/ProductDetail/Panasonic/ERJ-3EKF1022V?qs=LRVwtJ3DVID0bgL5Wde26A%3D%3D; Arrow Part Number: ERJ-3EKF1022V; Arrow Price/Stock: https://www.arrow.com/en/products/erj-3ekf1022v/panasonic; Supplier: Digikey; Supplier Part Number: P10.2KHCT-ND; Manufacturer: Panasonic; Manufacturer Part Number: ERJ-3EKF1022V; RoHS: Yes; Category: Chip SMD Resistors; Stock: 89233; Pricing: 1=0.1, 10=0.035, 100=0.0177, 1000=0.01014, 2500=0.00847 (USD); Mounting Technology: Surface Mount; Case/Package: 0603; Case Code (Metric): 1608; Case Code (Imperial): 0603; Contact Plating: Tin; Min Operating Temperature: -55°C; Max Operating Temperature: 155°C; Tolerance: 1%; Packaging: Tape and Reel; Package Quantity: 1; Resistor Type: Thick Film; Number of Terminations: 2; Termination: SMD/SMT; Max Power Dissipation: 100mW; Features: Automotive AEC-Q200; Series: ERJ; Resistance Tolerance: 1%; Construction: Rectangular; Technology: THICK FILM; Length: 1.6mm; Width: 0.8mm; Depth: 0.8mm; Radiation Hardening: No; Reach SVHC Compliant: No; Military Standard: Not; Lead Free: Lead Free; RoHS Compliant: Yes; ComponentLink1URL: https://datasheet.ciiva.com/34303/1987492-34303567.pdf?src-supplier=Jameco; ComponentLink1Description: https://datasheet.ciiva.com/34303/1987492-34303567.pdf?src-supplier=Jameco; ComponentLink2URL: https://datasheet.ciiva.com/30119/aoa0000ce2-30119176.pdf?src-supplier=Onlinecomponents.com; ComponentLink2Description: https://datasheet.ciiva.com/30119/aoa0000ce2-30119176.pdf?src-supplier=Onlinecomponents.com; ComponentLink3URL: https://datasheet.ciiva.com/43460/426256-43460540.pdf?src-supplier=Farnell; ComponentLink3Description: https://datasheet.ciiva.com/43460/426256-43460540.pdf?src-supplier=Farnell; ComponentLink4URL: https://datasheet.ciiva.com/9194/aoa0000ce2-9194057.pdf?src-supplier=Avnet; ComponentLink4Description: https://datasheet.ciiva.com/9194/aoa0000ce2-9194057.pdf?src-supplier=Avnet; ComponentLink5URL: https://datasheet.ciiva.com/16777/70260748-16777515.pdf?src-supplier=Allied+Electronics; ComponentLink5Description: https://datasheet.ciiva.com/16777/70260748-16777515.pdf?src-supplier=Allied+Electronics; ComponentLink6URL: https://datasheet.ciiva.com/24069/aoa0000ce2-24069678.pdf?src-supplier=Mouser; ComponentLink6Description: https://datasheet.ciiva.com/24069/aoa0000ce2-24069678.pdf?src-supplier=Mouser; ComponentLink7URL: https://datasheet.ciiva.com/28531/1678782-28531526.pdf?src-supplier=Element14; ComponentLink7Description: https://datasheet.ciiva.com/28531/1678782-28531526.pdf?src-supplier=Element14; ComponentLink8URL: https://datasheet.ciiva.com/28658/1678782-28658333.pdf?src-supplier=Element14; ComponentLink8Description: https://datasheet.ciiva.com/28658/1678782-28658333.pdf?src-supplier=Element14; ComponentLink9URL: https://datasheet.ciiva.com/46377/426256-46377339.pdf?src-supplier=Element14; ComponentLink9Description: https://datasheet.ciiva.com/46377/426256-46377339.pdf?src-supplier=Element14
R157 = ERJ-3EKF3742V: 37.4K Ohm 1% 1/10W ±100ppm/°C Molded SMD Punched Carrier T/R; Mfr_Name: Panasonic; Voltage Rating: 75V; Value: 37.4kR; Power Rating: 100mW; Supplier: Digikey; Supplier Part Number: P37.4KHCT-ND; Manufacturer: Panasonic; Manufacturer Part Number: ERJ-3EKF3742V; RoHS: Yes; Category: Chip SMD Resistors; Stock: 79144; Pricing: 1=0.1, 10=0.035, 100=0.0177, 1000=0.01014, 2500=0.00847 (USD); Mounting Technology: Surface Mount; Case/Package: 0603; Case Code (Metric): 1608; Case Code (Imperial): 0603; Min Operating Temperature: -55°C; Max Operating Temperature: 155°C; Packaging: Tape and Reel; Tolerance: 1%; Resistor Type: Thick Film; Temperature Coefficient: 100ppm/°C; Resistance Tolerance: 1%; Lead Free: Contains Lead; RoHS Compliant: Yes; Reach SVHC Compliant: Unknown; ComponentLink1URL: https://datasheet.ciiva.com/22668/1678782-22668168.pdf?src-supplier=Element14; ComponentLink1Description: https://datasheet.ciiva.com/22668/1678782-22668168.pdf?src-supplier=Element14; ComponentLink2URL: https://datasheet.ciiva.com/30172/aoa0000ce2-30172522.pdf?src-supplier=Onlinecomponents.com; ComponentLink2Description: https://datasheet.ciiva.com/30172/aoa0000ce2-30172522.pdf?src-supplier=Onlinecomponents.com; ComponentLink3URL: https://datasheet.ciiva.com/46419/1678782-46419947.pdf?src-supplier=Element14; ComponentLink3Description: https://datasheet.ciiva.com/46419/1678782-46419947.pdf?src-supplier=Element14; ComponentLink4URL: https://datasheet.ciiva.com/7870/aoa0000ce2-7870825.pdf?src-supplier=Element14; ComponentLink4Description: https://datasheet.ciiva.com/7870/aoa0000ce2-7870825.pdf?src-supplier=Element14
R158 = ERJ-3EKF1961V: 1.96K Ohm 1% 1/10W ±100ppm/°C Molded SMD Punched Carrier T/R; Mfr_Name: Panasonic; Voltage Rating: 75V; Value: 1.96kR; Power Rating: 100mW; Voltage Rating (DC): 50V; Supplier: Digikey; Supplier Part Number: P1.96KHCT-ND; Manufacturer: Panasonic; Manufacturer Part Number: ERJ-3EKF1961V; RoHS: Yes; Category: Chip SMD Resistors; Stock: 68295; Pricing: 1=0.1, 10=0.035, 100=0.0177, 1000=0.01014, 2500=0.00847 (USD); Mounting Technology: Surface Mount; Case/Package: 0603; Case Code (Metric): 1608; Case Code (Imperial): 0603; Weight: 7.1E-05oz; Contact Plating: Tin; Min Operating Temperature: -55°C; Max Operating Temperature: 155°C; Packaging: Tape and Reel; Tolerance: 1%; Package Quantity: 1; Resistor Type: Thick Film; Number of Terminations: 2; Termination: SMD/SMT; Temperature Coefficient: 100ppm/°C; Max Power Dissipation: 100mW; Features: Automotive AEC-Q200; Series: ERJ; Resistance Tolerance: 1%; Technology: THICK FILM; Construction: Rectangular; Length: 1.6mm; Width: 0.8mm; Height: 0.45mm; Depth: 0.8mm; Ratings: AEC-Q200; Reach SVHC Compliant: No; Military Standard: Not; Lead Free: Lead Free; RoHS Compliant: Yes; ComponentLink1URL: https://datasheet.ciiva.com/6201/426256-6201465.pdf?src-supplier=Farnell; ComponentLink1Description: https://datasheet.ciiva.com/6201/426256-6201465.pdf?src-supplier=Farnell; ComponentLink2URL: https://datasheet.ciiva.com/9197/aoa0000ce2-9197519.pdf?src-supplier=Avnet; ComponentLink2Description: https://datasheet.ciiva.com/9197/aoa0000ce2-9197519.pdf?src-supplier=Avnet; ComponentLink3URL: https://datasheet.ciiva.com/16775/70260748-16775147.pdf?src-supplier=Allied+Electronics; ComponentLink3Description: https://datasheet.ciiva.com/16775/70260748-16775147.pdf?src-supplier=Allied+Electronics; ComponentLink4URL: https://datasheet.ciiva.com/28610/1678782-28610985.pdf?src-supplier=Element14; ComponentLink4Description: https://datasheet.ciiva.com/28610/1678782-28610985.pdf?src-supplier=Element14; ComponentLink5URL: https://datasheet.ciiva.com/28658/1678782-28658365.pdf?src-supplier=Element14; ComponentLink5Description: https://datasheet.ciiva.com/28658/1678782-28658365.pdf?src-supplier=Element14; ComponentLink6URL: https://datasheet.ciiva.com/46377/426256-46377743.pdf?src-supplier=Element14; ComponentLink6Description: https://datasheet.ciiva.com/46377/426256-46377743.pdf?src-supplier=Element14; ComponentLink7URL: https://datasheet.ciiva.com/46389/426256-46389227.pdf?src-supplier=Element14; ComponentLink7Description: https://datasheet.ciiva.com/46389/426256-46389227.pdf?src-supplier=Element14; ComponentLink8URL: https://datasheet.ciiva.com/24162/aoa0000ce2-24162888.pdf?src-supplier=Mouser; ComponentLink8Description: https://datasheet.ciiva.com/24162/aoa0000ce2-24162888.pdf?src-supplier=Mouser